# EasyEDA Pro project STM32F429BIT6 IGT6外围.epro, board 最终打板文件
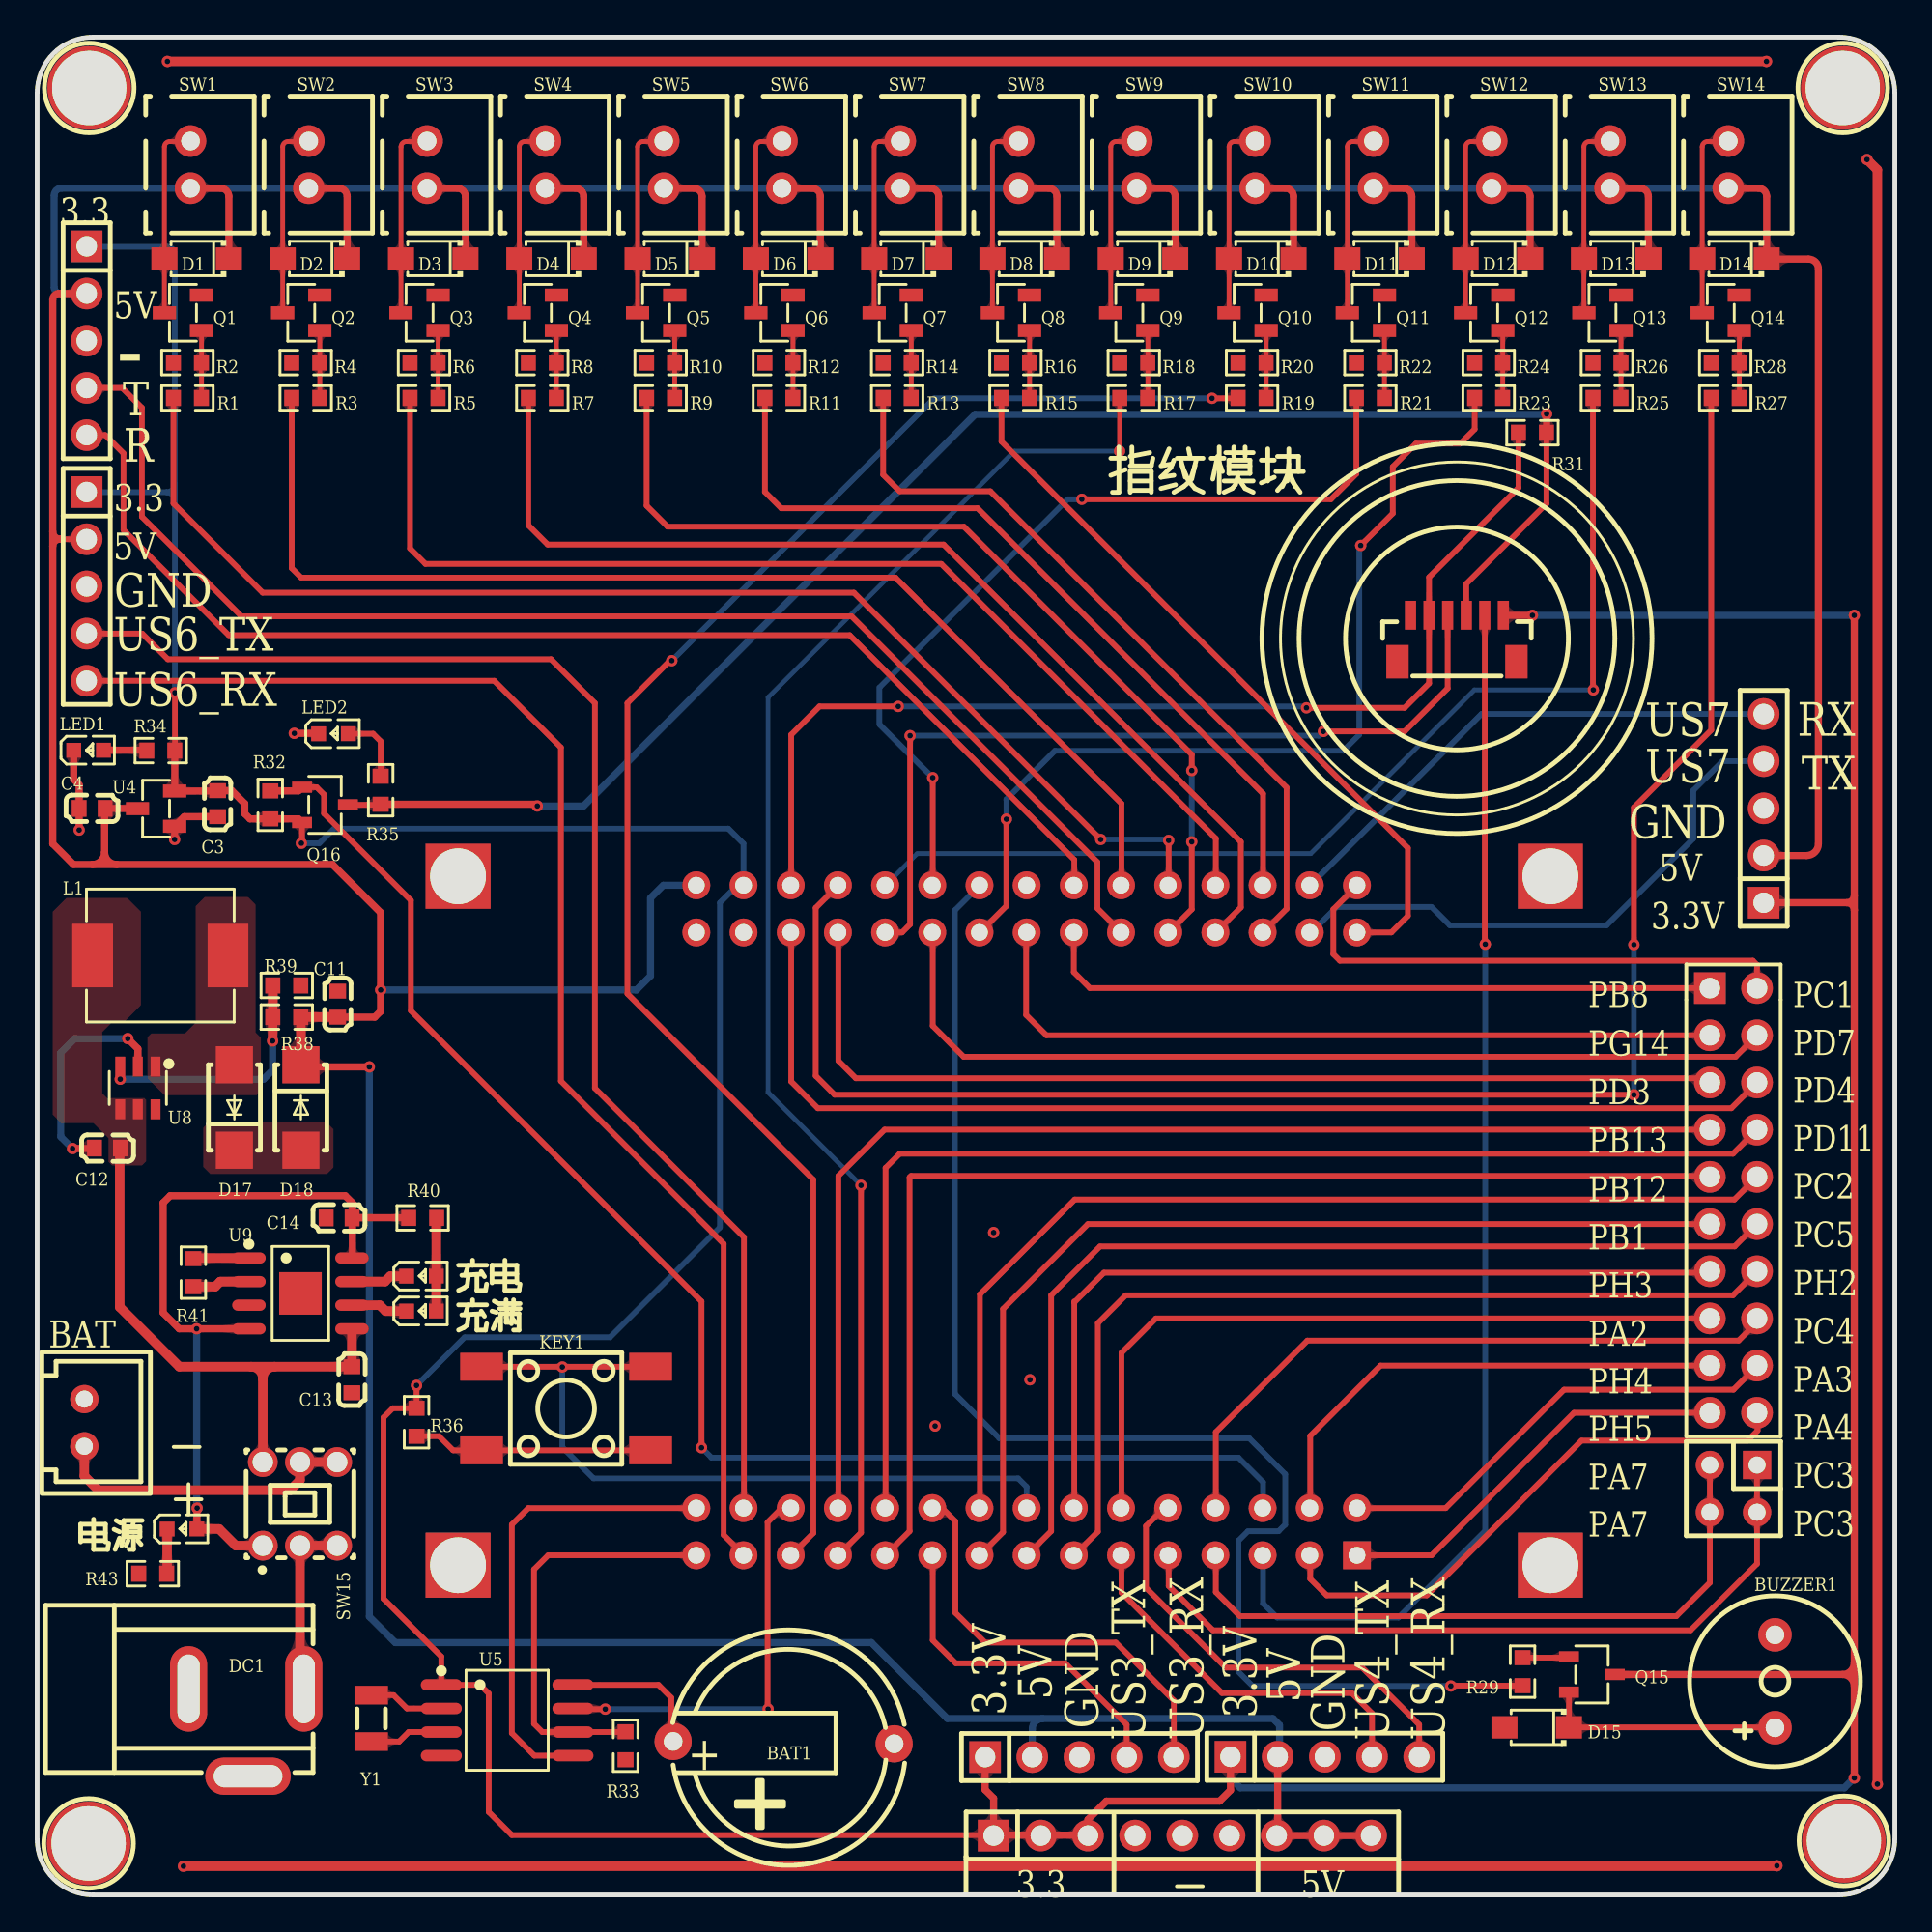
[diagram p5: board, top side]
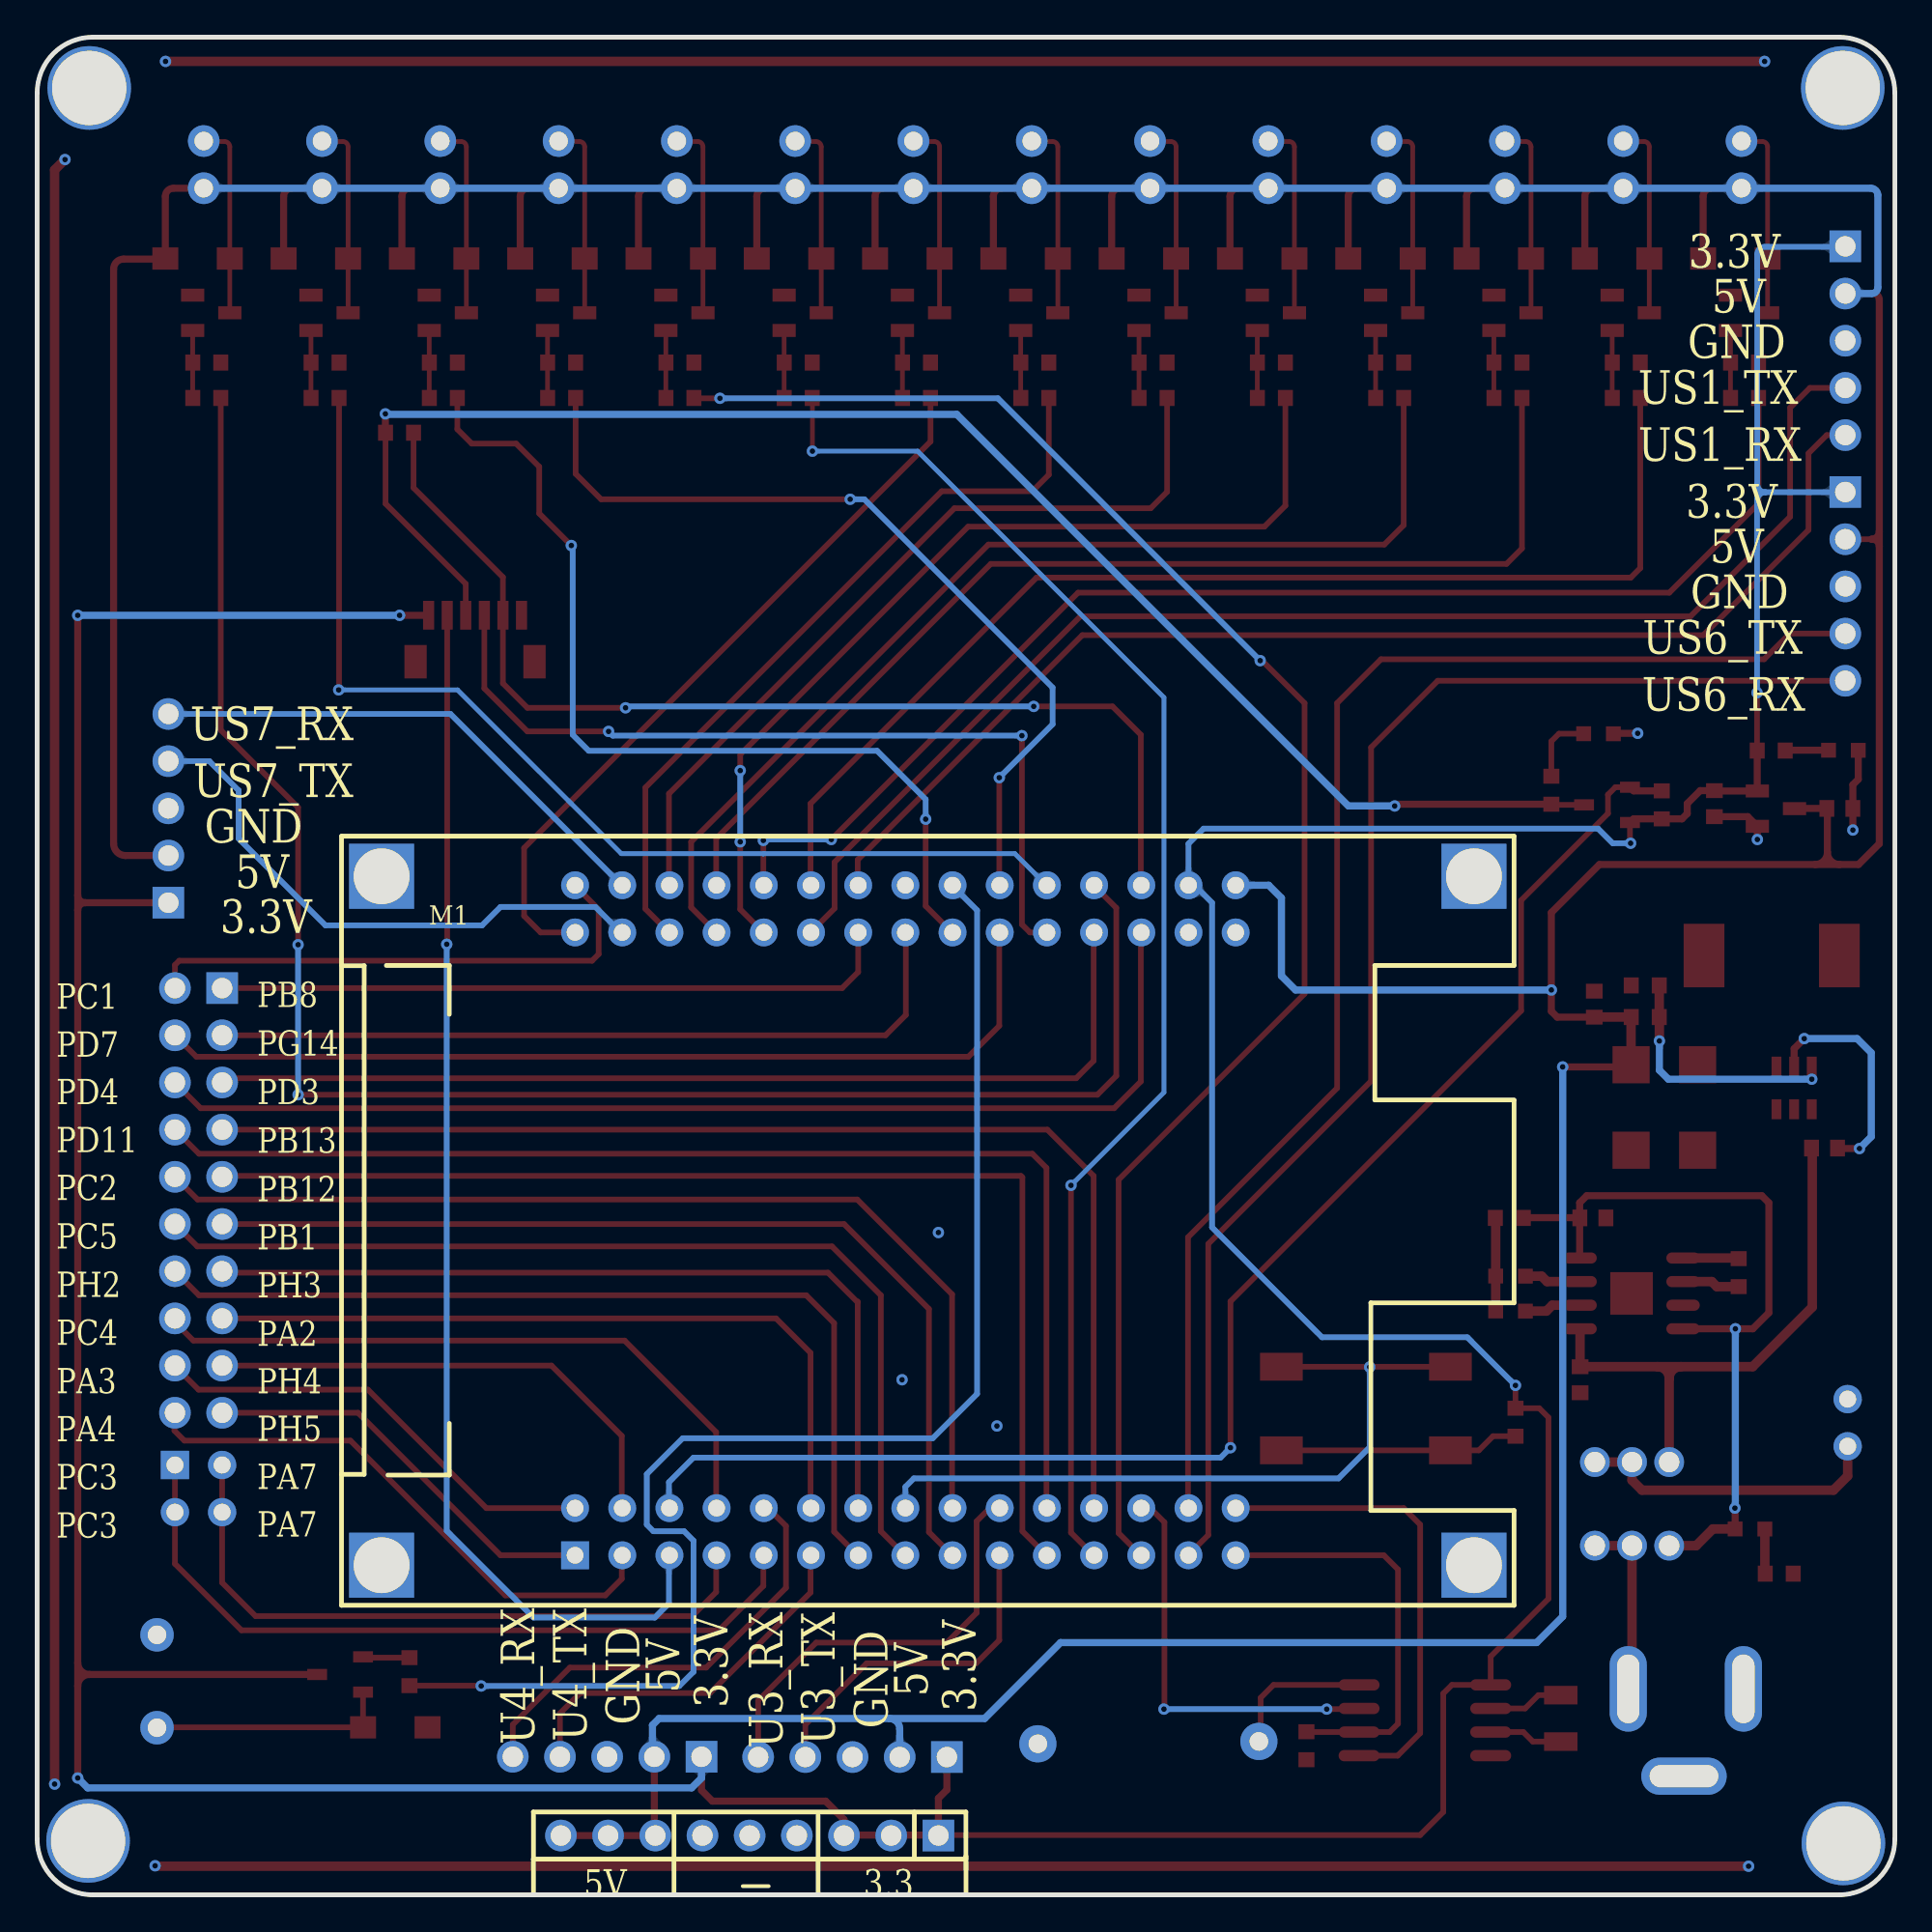
[diagram p6: board, bottom side, seen from below]

Outline 100 x 100 mm; copper layers: Top Layer, Bottom Layer. Coordinates in mm from the lower left corner of the outline.
Outline path: 0,97 0,3 arc(0.88,0.88) 3,0 97,0 arc(99.12,0.88) 100,3 100,97 arc(99.12,99.12) 97,100 3,100 arc(0.88,99.12) 0,97
Stack: Top Layer 0.035mm / Dielectric1 1.51mm FR4 er 4.5 / Bottom Layer 0.035mm

## Design rules (mm)
template: JLCPCB Capability(Two Layers Board)
spacing copperThickness1oz (default): track to track 0.102, other pairs 0.152 to 0.3
spacing copperThickness2oz: track to track 0.203, other pairs 0.152 to 0.3
track width copperThickness1oz (default): min 0.127, default 0.254, max 2.54
track width copperThickness2oz: min 0.203, default 0.254, max 2.54
differential pair differentialPair (default): width min 0.127, default 0.254, max 2.54; gap min 0.152, default 0.152
via viaSize (default): diameter min 0.5, default 0.61, max 10; hole min 0.3, default 0.305, max 6.3

## Placement (name value [footprint] x y rotation side)
BAT1  CR1220-H DIP  [BAT-TH_CR1220-H-DIP]  40.18 8.19 180 top
BUZZER1  2800Hz  [BUZ-TH_BD9.0-P5.00-D0.6-FD]  93.55 11.5 90 top
C3  1uF  [C0603]  9.71 58.74 90 top
C4  1uF  [C0603]  2.96 58.48 0 top
C11  22uF  [C0603]  16.18 47.95 270 top
C12  22uF  [C0603]  3.78 40.2 180 top
C13  10uF  [C0603]  16.94 27.73 270 top
C14  10uF  [C0603]  16.26 36.44 0 top
CN16  XH2.54-LI-2P  [CONN-TH_2P-P2.54_HDR2]  2.54 25.42 270 top
D1  DSK34  [SOD-123FL_L2.7-W1.8-LS3.8-RD]  8.59 88.08 180 top
D2  DSK34  [SOD-123FL_L2.7-W1.8-LS3.8-RD]  14.95 88.08 180 top
D3  DSK34  [SOD-123FL_L2.7-W1.8-LS3.8-RD]  21.32 88.08 180 top
D4  DSK34  [SOD-123FL_L2.7-W1.8-LS3.8-RD]  27.69 88.08 180 top
D5  DSK34  [SOD-123FL_L2.7-W1.8-LS3.8-RD]  34.06 88.08 180 top
D6  DSK34  [SOD-123FL_L2.7-W1.8-LS3.8-RD]  40.42 88.08 180 top
D7  DSK34  [SOD-123FL_L2.7-W1.8-LS3.8-RD]  46.79 88.08 180 top
D8  DSK34  [SOD-123FL_L2.7-W1.8-LS3.8-RD]  53.16 88.08 180 top
D9  DSK34  [SOD-123FL_L2.7-W1.8-LS3.8-RD]  59.53 88.08 180 top
D10  DSK34  [SOD-123FL_L2.7-W1.8-LS3.8-RD]  65.89 88.08 180 top
D11  DSK34  [SOD-123FL_L2.7-W1.8-LS3.8-RD]  72.26 88.08 180 top
D12  DSK34  [SOD-123FL_L2.7-W1.8-LS3.8-RD]  78.63 88.08 180 top
D13  DSK34  [SOD-123FL_L2.7-W1.8-LS3.8-RD]  85 88.08 180 top
D14  DSK34  [SOD-123FL_L2.7-W1.8-LS3.8-RD]  91.37 88.08 180 top
D15  DSK34  [SOD-123FL_L2.7-W1.8-LS3.8-RD]  80.72 9.02 180 top
D17  SS34  [DO-214AC_L4.3-W2.7-LS5.2-RD]  10.62 42.38 90 top
D18  SS34  [DO-214AC_L4.3-W2.7-LS5.2-RD]  14.2 42.38 270 top
DC1  DC005  [DC-IN-TH_DC005]  11.25 8.74 0 top
H1  -  [HDR-TH_5P-P2.54-V-M]  2.67 83.66 270 top
H2  -  [HDR-TH_5P-P2.54-V-M]  56.11 7.42 0 top
H3  -  [HDR-TH_5P-P2.54-V-M]  2.67 70.43 270 top
H4  -  [HDR-TH_5P-P2.54-V-M]  69.32 7.43 0 top
H5  -  [HDR-TH_5P-P2.54-V-M]  92.94 58.49 90 top
H6  -  [HDR-TH_9P-P2.54-V-M]  61.65 3.19 0 top
H7  -  [HDR-TH_20P-P2.54-V-M-R2-C10-S2.54]  91.31 37.38 270 top
H8  -  [HDR-TH_4P-P2.54-V-M-R2-C2-S2.54-1]  91.31 21.87 180 top
KEY1  -  [SW-SMD_4P-L6.0-W6.0-P4.50-LS9.0-2]  28.47 26.18 0 top
L1  0650-22UH  [IND-SMD_L7.8-W7.0_MAPM0630F]  6.63 50.56 180 top
LED1  -  [LED_0603]  2.82 61.62 0 top
LED2  -  [LED_0603]  16 62.51 0 top
LED3  -  [LED_0603]  20.74 33.31 0 top
LED4  -  [LED_0603]  20.74 31.43 0 top
LED5  -  [LED_0603]  7.85 19.7 0 top
M1  STM32F429BIT6-Module  [STM32F429BI_CORE]  53.26 36.31 180 bottom
Q1  AO3400  [SOT-23-3_L2.9-W1.3-P1.90-LS2.4-BR]  7.85 85.16 0 top
Q2  AO3400  [SOT-23-3_L2.9-W1.3-P1.90-LS2.4-BR]  14.22 85.16 0 top
Q3  AO3400  [SOT-23-3_L2.9-W1.3-P1.90-LS2.4-BR]  20.58 85.16 0 top
Q4  AO3400  [SOT-23-3_L2.9-W1.3-P1.90-LS2.4-BR]  26.95 85.16 0 top
Q5  AO3400  [SOT-23-3_L2.9-W1.3-P1.90-LS2.4-BR]  33.32 85.16 0 top
Q6  AO3400  [SOT-23-3_L2.9-W1.3-P1.90-LS2.4-BR]  39.69 85.16 0 top
Q7  AO3400  [SOT-23-3_L2.9-W1.3-P1.90-LS2.4-BR]  46.06 85.16 0 top
Q8  AO3400  [SOT-23-3_L2.9-W1.3-P1.90-LS2.4-BR]  52.42 85.16 0 top
Q9  AO3400  [SOT-23-3_L2.9-W1.3-P1.90-LS2.4-BR]  58.79 85.16 0 top
Q10  AO3400  [SOT-23-3_L2.9-W1.3-P1.90-LS2.4-BR]  65.16 85.16 0 top
Q11  AO3400  [SOT-23-3_L2.9-W1.3-P1.90-LS2.4-BR]  71.53 85.16 0 top
Q12  AO3400  [SOT-23-3_L2.9-W1.3-P1.90-LS2.4-BR]  77.89 85.16 0 top
Q13  AO3400  [SOT-23-3_L2.9-W1.3-P1.90-LS2.4-BR]  84.26 85.16 0 top
Q14  AO3400  [SOT-23-3_L2.9-W1.3-P1.90-LS2.4-BR]  90.63 85.16 0 top
Q15  S8050  [SOT-23-3_L2.9-W1.6-P1.90-LS2.8-BR]  83.69 11.86 180 top
Q16  SI2305  [SOT-23-3_L2.9-W1.6-P1.90-LS2.8-BR]  15.49 58.67 180 top
R1  1K  [R0603]  8.09 80.58 0 top
R2  10K  [R0603]  8.09 82.48 180 top
R3  1K  [R0603]  14.46 80.58 0 top
R4  10K  [R0603]  14.46 82.48 180 top
R5  1K  [R0603]  20.83 80.58 0 top
R6  10K  [R0603]  20.83 82.48 180 top
R7  1K  [R0603]  27.19 80.58 0 top
R8  10K  [R0603]  27.19 82.48 180 top
R9  1K  [R0603]  33.56 80.58 0 top
R10  10K  [R0603]  33.56 82.48 180 top
R11  1K  [R0603]  39.93 80.58 0 top
R12  10K  [R0603]  39.93 82.48 180 top
R13  1K  [R0603]  46.3 80.58 0 top
R14  10K  [R0603]  46.3 82.48 180 top
R15  1K  [R0603]  52.66 80.58 0 top
R16  10K  [R0603]  52.66 82.48 180 top
R17  1K  [R0603]  59.03 80.58 0 top
R18  10K  [R0603]  59.03 82.48 180 top
R19  1K  [R0603]  65.4 80.58 0 top
R20  10K  [R0603]  65.4 82.48 180 top
R21  1K  [R0603]  71.77 80.58 0 top
R22  10K  [R0603]  71.77 82.48 180 top
R23  1K  [R0603]  78.13 80.58 0 top
R24  10K  [R0603]  78.13 82.48 180 top
R25  1K  [R0603]  84.5 80.58 0 top
R26  10K  [R0603]  84.5 82.48 180 top
R27  1K  [R0603]  90.87 80.58 0 top
R28  10K  [R0603]  90.87 82.48 180 top
R29  1K  [R0603]  79.96 12.01 90 top
R31  10K  [R0603]  80.49 78.71 0 top
R32  100K  [R0603]  12.55 58.67 270 top
R33  10K  [R0603]  31.67 8.03 90 top
R34  5.1K  [R0603]  6.66 61.59 0 top
R35  5.1K  [R0603]  18.49 59.46 270 top
R36  1K  [R0603]  20.42 25.44 90 top
R38  16K  [R0603]  13.44 47.25 0 top
R39  2.2K  [R0603]  13.44 48.95 180 top
R40  1K  [R0603]  20.75 36.44 180 top
R41  RPOG-1k  [R0603]  8.41 33.49 270 top
R43  5.1K  [R0603]  6.22 17.29 0 top
SW1  B2B-XH-A(LF)(SN)  [CONN-TH_B2B-XH-A-LF-SN]  8.25 93.14 270 top
SW2  B2B-XH-A(LF)(SN)  [CONN-TH_B2B-XH-A-LF-SN]  14.62 93.14 270 top
SW3  B2B-XH-A(LF)(SN)  [CONN-TH_B2B-XH-A-LF-SN]  20.99 93.14 270 top
SW4  B2B-XH-A(LF)(SN)  [CONN-TH_B2B-XH-A-LF-SN]  27.36 93.14 270 top
SW5  B2B-XH-A(LF)(SN)  [CONN-TH_B2B-XH-A-LF-SN]  33.73 93.14 270 top
SW6  B2B-XH-A(LF)(SN)  [CONN-TH_B2B-XH-A-LF-SN]  40.09 93.14 270 top
SW7  B2B-XH-A(LF)(SN)  [CONN-TH_B2B-XH-A-LF-SN]  46.46 93.14 270 top
SW8  B2B-XH-A(LF)(SN)  [CONN-TH_B2B-XH-A-LF-SN]  52.83 93.14 270 top
SW9  B2B-XH-A(LF)(SN)  [CONN-TH_B2B-XH-A-LF-SN]  59.2 93.14 270 top
SW10  B2B-XH-A(LF)(SN)  [CONN-TH_B2B-XH-A-LF-SN]  65.56 93.14 270 top
SW11  B2B-XH-A(LF)(SN)  [CONN-TH_B2B-XH-A-LF-SN]  71.93 93.14 270 top
SW12  B2B-XH-A(LF)(SN)  [CONN-TH_B2B-XH-A-LF-SN]  78.3 93.14 270 top
SW13  B2B-XH-A(LF)(SN)  [CONN-TH_B2B-XH-A-LF-SN]  84.67 93.14 270 top
SW14  B2B-XH-A(LF)(SN)  [CONN-TH_B2B-XH-A-LF-SN]  91.03 93.14 270 top
SW15  自锁开关 5.8Z白灰白260G  [SW-TH_6P-L5.8-W5.8-P2.00-LS4.5-TR]  14.15 21.05 180 top
TP1  -  [M4螺丝]  2.77 2.77 0 top
TP2  -  [M4螺丝]  97.26 2.9 0 top
TP3  -  [M4螺丝]  2.8 97.27 0 top
TP4  -  [M4螺丝]  97.2 97.27 0 top
U2  指纹模块  [conn-smd_a1002wv-s-6p]  76.43 67.63 0 top
U4  XC6206  [SOT-23-3_L2.9-W1.3-P1.90-LS2.4-BR]  6.4 58.47 0 top
U5  DS1302S+TR  [SOP-8_L5.3-W5.3-P1.27-LS8.0-BL]  25.3 9.4 270 top
U8  MT3608  [SOT-23-6_L2.9-W1.6-P0.95-LS2.8-BL]  5.42 43.44 180 top
U9  AP5056  [SOP-8_L4.9-W3.9-P1.27-LS6.0-BL-EP]  14.17 32.38 270 top
Y1  32.768kHz  [FC-135R_L3.2-W1.5]  17.98 9.5 90 top

## Footprints (pads in the part's own frame, mm; a bottom-side part is the same pattern mirrored in y, then rotated)
BAT-TH_CR1220-H-DIP
  round 2 hole 1: 1(-5.949,0.064) 2(5.949,-0.064)
BUZ-TH_BD9.0-P5.00-D0.6-FD
  round 1.8 hole 1: 1(-2.5,0) 2(2.5,0)
C0603
  rect 0.8x0.9 smd: 1(-0.7,0) 2(0.7,0)
conn-smd_a1002wv-s-6p
  rect 0.6x1.55 smd: 1(2.499,1.251) 2(1.499,1.251) 3(0.501,1.25) 4(-0.501,1.251) 5(-1.501,1.251) 6(-2.501,1.251)
  rect 1.2x1.8 smd: 7(3.201,-1.251) 8(-3.201,-1.251)
CONN-TH_2P-P2.54_HDR2
  round 1.524 hole 0.914: 1(1.27,0) 2(-1.27,0)
CONN-TH_B2B-XH-A-LF-SN
  round 1.7 hole 1: 1(1.27,0) 2(-1.27,0)
DC-IN-TH_DC005
  oval 2x4.6 hole 1.2x3.7: 1(3.1,2.35) 2(-3.1,2.35)
  oval 4.6x2 hole 3.7x1.2: 3(0.1,-2.35)
DO-214AC_L4.3-W2.7-LS5.2-RD
  rect 2x2 smd: 1(-2.3,0) 2(2.3,0)
FC-135R_L3.2-W1.5
  rect 1x1.8 smd: 1(-1.25,0) 2(1.25,0)
HDR-TH_4P-P2.54-V-M-R2-C2-S2.54-1
  rect 1.524x1.524 hole 0.914: 1(-1.27,-1.27)
  round 1.524 hole 0.914: 2(-1.27,1.27) 3(1.27,-1.27) 4(1.27,1.27)
HDR-TH_5P-P2.54-V-M
  rect 1.7x1.7 hole 1.1: 1(-5.08,0)
  round 1.7 hole 1.1: 2(-2.54,0) 3(0,0) 4(2.54,0) 5(5.08,0)
HDR-TH_9P-P2.54-V-M
  rect 1.7x1.7 hole 1.1: 1(-10.16,0)
  round 1.7 hole 1.1: 2(-7.62,0) 3(-5.08,0) 4(-2.54,0) 5(0,0) 6(2.54,0) 7(5.08,0) 8(7.62,0) 9(10.16,0)
HDR-TH_20P-P2.54-V-M-R2-C10-S2.54
  rect 1.7x1.7 hole 1.1: 1(-11.43,-1.27)
  round 1.7 hole 1.1: 2(-11.43,1.27) 3(-8.89,-1.27) 4(-8.89,1.27) 5(-6.35,-1.27) 6(-6.35,1.27) 7(-3.81,-1.27) 8(-3.81,1.27) 9(-1.27,-1.27) 10(-1.27,1.27) 11(1.27,-1.27) 12(1.27,1.27) 13(3.81,-1.27) 14(3.81,1.27) 15(6.35,-1.27) 16(6.35,1.27) 17(8.89,-1.27) 18(8.89,1.27) 19(11.43,-1.27) 20(11.43,1.27)
IND-SMD_L7.8-W7.0_MAPM0630F
  rect 2.194x3.42 smd: 1(3.643,0) 2(-3.643,0)
LED_0603
  rect 0.8x0.8 smd: 1(-0.851,-0.01) 2(0.75,-0.005)
M4螺丝
  round 4.5 hole 4: 1(0,0)
R0603
  rect 0.806x0.864 smd: 1(-0.753,0) 2(0.753,0)
SOD-123FL_L2.7-W1.8-LS3.8-RD
  rect 1.4x1.2 smd: 1(-1.735,0) 2(1.735,0)
SOP-8_L4.9-W3.9-P1.27-LS6.0-BL-EP
  oval 0.6x1.8 smd: 1(-1.905,-2.772) 2(-0.635,-2.772) 3(0.635,-2.772) 4(1.905,-2.772) 5(1.905,2.772) 6(0.635,2.772) 7(-0.635,2.772) 8(-1.905,2.772)
  rect 2.29x2.29 smd: 9(0,0)
SOP-8_L5.3-W5.3-P1.27-LS8.0-BL
  oval 0.609x2.204 smd: 1(-1.905,-3.542) 2(-0.635,-3.542) 3(0.635,-3.542) 4(1.905,-3.542) 5(1.905,3.542) 6(0.635,3.542) 7(-0.635,3.542) 8(-1.905,3.542)
SOT-23-3_L2.9-W1.3-P1.90-LS2.4-BR
  rect 1.25x0.7 smd: 1(1,-0.95) 2(1,0.95) 3(-1,0)
SOT-23-3_L2.9-W1.6-P1.90-LS2.8-BR
  rect 1.07x0.6 smd: 1(1.235,-0.95) 2(1.235,0.95) 3(-1.235,0)
SOT-23-6_L2.9-W1.6-P0.95-LS2.8-BL
  rect 0.532x1.072 smd: 1(-0.95,-1.149) 2(0,-1.149) 3(0.95,-1.149) 4(0.95,1.149) 5(0,1.149) 6(-0.95,1.149)
STM32F429BI_CORE
  rect 3.5x3.5 hole 3.005x3: 0(30.607,18.517) 61(30.607,-18.567) 62(-28.194,-18.567) 63(-28.194,18.517)
  rect 1.5x1.5 hole 0.905x0.9: 1(-17.78,-18.034)
  round 1.5 hole 0.905x0.9: 2(-17.78,-15.494) 3(-15.24,-18.034) 4(-15.24,-15.494) 5(-12.7,-18.034) 6(-12.7,-15.494) 7(-10.16,-18.034) 8(-10.16,-15.494) 9(-7.62,-18.034) 10(-7.62,-15.494) 11(-5.08,-18.034) 12(-5.08,-15.494) 13(-2.54,-18.034) 14(-2.54,-15.494) 15(0,-18.034) 16(0,-15.494) 17(2.54,-18.034) 18(2.54,-15.494) 19(5.08,-18.034) 20(5.08,-15.494) 21(7.62,-18.034) 22(7.62,-15.494) 23(10.16,-18.034) 24(10.16,-15.494) 25(12.7,-18.034) 26(12.7,-15.494) 27(15.24,-18.034) 28(15.24,-15.494) 29(17.78,-18.034) 30(17.78,-15.494) 31(-17.78,15.494) 32(-17.78,18.034) 33(-15.24,15.494) 34(-15.24,18.034) 35(-12.7,15.494) 36(-12.7,18.034) 37(-10.16,15.494) 38(-10.16,18.034) 39(-7.62,15.494) 40(-7.62,18.034) 41(-5.08,15.494) 42(-5.08,18.034) 43(-2.54,15.494) 44(-2.54,18.034) 45(0,15.494) 46(0,18.034) 47(2.54,15.494) 48(2.54,18.034) 49(5.08,15.494) 50(5.08,18.034) 51(7.62,15.494) 52(7.62,18.034) 53(10.16,15.494) 54(10.16,18.034) 55(12.7,15.494) 56(12.7,18.034) 57(15.24,15.494) 58(15.24,18.034) 59(17.78,15.494) 60(17.78,18.034)
SW-SMD_4P-L6.0-W6.0-P4.50-LS9.0-2
  rect 2.3x1.5 smd: 1(-4.55,2.25) 2(4.55,2.25) 3(-4.55,-2.25) 4(4.55,-2.25)
SW-TH_6P-L5.8-W5.8-P2.00-LS4.5-TR
  round 1.6 hole 1.1: 1(2,2.25) 2(0,2.25) 3(-2,2.25) 4(-2,-2.25) 5(0,-2.25) 6(2,-2.25)

## Nets
As in the schematic, except:
$4N6183: LED3.2 LED4.2 R40.1
$4N6184: LED3.1 U9.7
$4N6185: LED4.1 U9.6

Pads without a net: M1 0 46 57 61 62 63; TP1 1; TP2 1; TP3 1; TP4 1; U2 7 8; U8 6

## Via types
v1: diameter 0.61, hole 0.305, Top Layer to Bottom Layer, 53 vias

## Routing (per net, layer and track width the routed paths; a pad name or vN(x,y) marks a point on that pad's centre or on a via; arc(x,y) is an arc through that point)
+3.3V: length 327.1
  Top Layer w0.305: R34.2 7.42,61.6 v1(7.42,64.71) ; 51.49,3.22 25.55,3.22 24.31,4.46 24.31,10.84 23.84,11.3 U5.1 21.76,12.83 18.64,15.94 18.64,25.7 19.14,26.19 R36.2 v1(20.42,27.42) ; Q16.2 14.26,56.61 v1(14.23,56.61)
  Top Layer w0.381: 97.82,11.23 97.82,12.49 ; 97.82,11.23 v1(97.82,6.29) ; 97.82,11.23 arc(97.63,11.68) 97.19,11.86 ; 97.82,12.49 97.82,53.01 ; 97.82,12.49 arc(97.63,12.05) 97.19,11.86 ; v1(80.49,68.88) 78.93,68.88 U2.1 ; Q16.2 14.06,57.92 R32.2 11.46,57.92 11.18,58.2 11.18,58.74 10.48,59.44 C3.2 9.7,59.42 U4.2 7.41,59.43 R34.2 ; 97.82,53.81 v1(97.82,68.88) ; 97.82,53.81 97.82,53.01 ; 97.82,53.81 arc(97.7,53.52) 97.42,53.41 ; 97.82,53.01 arc(97.7,53.29) 97.42,53.41 ; H4.1 64.24,5.63 63.65,5.05 57.56,5.05 56.57,4.06 H6.3 56.54,3.22 51.49,3.22 51.49,5.2 51.03,5.66 H2.1 ; 97.42,53.41 H5.1 ; Q15.3 97.19,11.86
  Bottom Layer w0.305: 7.41,75.94 7.41,88.32 arc(7.29,88.6) 7.01,88.71 2.69,88.71 H1.1 ; 7.41,75.94 7.42,75.93 v1(7.42,64.71) ; 7.41,75.94 arc(7.28,75.63) 6.98,75.5 6.97,75.5 ; 6.97,75.5 2.68,75.5 H3.1 ; 6.97,75.5 arc(7.28,75.38) 7.41,75.06 ; v1(14.22,56.61) 15.19,56.61 15.98,57.39 37.21,57.39 38.02,56.58 M1.58 37.69,54.35 36.75,53.41 36.75,35.93 30.84,30.01 23.01,30.01 v1(20.42,27.42)
  Bottom Layer w0.381: v1(97.82,68.88) v1(80.49,68.88) ; v1(97.82,6.29) 97.28,5.76 64.77,5.76 64.24,6.29 H4.1
+5V: length 405.5
  Top Layer w0.305: 1.25,72.97 H3.2
  Top Layer w0.381: D3.1 23.06,91.43 arc(22.93,91.74) 22.62,91.87 SW3.1 ; 0.84,72.59 0.84,56.58 1.96,55.46 2.98,55.46 ; 0.84,72.59 0.84,73.39 ; 0.84,72.59 arc(0.95,72.86) 1.22,72.97 1.25,72.97 arc(0.96,73.1) 0.84,73.39 ; SW4.1 28.98,91.87 arc(29.29,91.74) 29.42,91.43 D4.1 ; SW6.1 41.72,91.87 arc(42.03,91.74) 42.16,91.43 D6.1 ; D5.1 35.79,91.43 arc(35.66,91.74) 35.35,91.87 SW5.1 ; SW11.1 73.56,91.87 arc(73.87,91.74) 74,91.43 D11.1 ; SW14.1 92.66,91.87 arc(92.97,91.74) 93.1,91.43 D14.1 93.13,88.05 95.35,88.05 arc(95.73,87.9) 95.88,87.52 95.88,56.58 arc(95.7,56.13) 95.25,55.95 H5.2 ; D2.1 16.69,91.43 arc(16.56,91.74) 16.25,91.87 SW2.1 ; SW7.1 48.09,91.87 arc(48.4,91.74) 48.53,91.43 D7.1 ; 4.29,55.46 15.9,55.46 18.49,52.87 v1(18.49,48.71) 18.49,47.56 18.17,47.25 C11.2 ; 4.29,55.46 2.98,55.46 ; 4.29,55.46 arc(3.82,55.66) 3.63,56.12 ; 2.98,55.46 arc(3.44,55.66) 3.63,56.12 ; SW8.1 54.45,91.87 arc(54.77,91.74) 54.89,91.43 D8.1 ; v1(17.88,44.57) 14.31,44.57 D18.1 ; SW1.1 9.88,91.87 arc(10.19,91.74) 10.32,91.43 D1.1 ; D13.1 86.73,91.43 arc(86.6,91.74) 86.29,91.87 SW13.1 ; U4.3 5.39,58.48 C4.2 3.63,58.45 3.63,56.12 ; H4.2 66.78,3.24 66.73,3.19 H6.9 ; D10.1 67.63,91.43 arc(67.5,91.74) 67.19,91.87 SW10.1 ; SW9.1 60.82,91.87 arc(61.13,91.74) 61.26,91.43 61.26,88.08 ; 0.84,73.39 0.84,85.87 arc(0.93,86.1) 1.17,86.2 H1.2 ; D12.1 80.37,91.43 arc(80.24,91.74) 79.93,91.87 SW12.1
  Top Layer w0.508: C11.2 16.17,47.25 14.19,47.25 14.2,47.24 D18.1
  Bottom Layer w0.381: H2.2 53.57,8.93 arc(53.64,9.2) 53.83,9.41 arc(53.97,9.47) 54.13,9.49 ; v1(17.88,44.57) 17.88,14.98 19.28,13.58 44.91,13.58 49,9.49 54.13,9.49 ; H1.2 1.24,86.2 arc(1.01,86.3) 0.91,86.53 0.91,91.48 arc(1.03,91.75) 1.3,91.87 SW1.1 SW2.1 SW3.1 SW4.1 SW5.1 SW6.1 SW7.1 SW8.1 SW9.1 SW10.1 SW11.1 SW12.1 SW13.1 SW14.1 ; H4.2 66.88,7.53 66.88,9.13 66.52,9.49 54.13,9.49 ; 18.49,48.71 32.26,48.71 33.02,49.47 33.02,53.66 33.71,54.35 M1.60
GND: length 283.8
  Top Layer w0.381: C12.2 3.06,40.17 v1(1.91,40.17) ; v1(2.26,57.32) C4.1 2.26,59.76 1.97,60.05 LED1.1 ; C3.1 7.92,58.04 U4.1 v1(7.4,56.81) ; U8.2 5.42,45.55 v1(4.88,46.09) ; v1(13.84,62.53) 15.12,62.53 LED2.1
  Top Layer w0.508: v1(93.09,98.7) v1(7.01,98.7) ; U9.1 8.44,34.28 R41.1 ; v1(99.06,5.96) 99.06,92.85 v1(98.5,93.41) ; v1(7.87,1.54) 93.62,1.54 v1(93.65,1.57)
  Bottom Layer w0.381: v1(1.91,40.17) 1.27,40.81 1.27,45.33 2.03,46.09 v1(4.88,46.09)
  Bottom Layer w0.508: v1(93.09,98.7) 93.09,98.67
  vias: v1(48.34,25.24) v1(51.49,35.65) v1(53.44,27.73)
VBAT: length 31
  Top Layer w0.508: C12.1 4.45,40.16 4.45,31.64 7.65,28.43 11.52,28.43 ; 12.15,27.8 12.15,27.85 ; 12.15,27.8 SW15.6 ; 12.15,27.8 arc(12.33,28.25) 12.78,28.43 ; 12.15,27.8 arc(11.96,28.25) 11.52,28.43 ; 11.52,28.43 12.78,28.43 ; 12.78,28.43 16.95,28.43 ; 16.95,28.43 U9.5 ; 16.95,28.43 C13.1
VCC: length 42.1
  Top Layer w0.381: 16.97,36.45 C14.2 ; 16.97,36.45 19.99,36.45 R40.2 ; 16.97,36.45 16.97,34.3 U9.8 ; 16.97,36.45 16.97,37.25 16.59,37.63 7.16,37.63 6.78,37.25 6.78,31.33 7.65,30.47 v1(8.59,30.47) U9.4 ; v1(8.61,20.82) 8.6,20.81 LED5.2
  Top Layer w0.508: LED5.2 9.79,19.7 10.69,18.8 SW15.1
  Bottom Layer w0.381: v1(8.59,30.47) 8.59,20.84 v1(8.61,20.82)
AF8_USART4_RX: length 24.4
  Top Layer w0.305: H4.5 74.4,9.16 71.32,12.23 63.98,12.23 59.69,16.53 59.69,19.85 60.66,20.82 60.91,20.82
AF8_USART4_TX: length 20.5
  Top Layer w0.305: H4.4 71.86,9.77 70.76,10.86 63.78,10.86 58.37,16.27 58.37,18.28
AF8_USART7_RX: length 28.2
  Bottom Layer w0.305: 68.53,54.35 77.75,63.57 H5.5
AF8_USART7_TX: length 30.6
  Bottom Layer w0.305: H5.4 90.73,61.03 89.15,59.45 89.15,56.86 84.48,52.19 76.05,52.19 75.06,53.18 69.95,53.18 68.58,51.81 68.53,51.81
BUZZER: length 75.8
  Top Layer w0.305: v1(76.1,11.24) 76.12,11.26 R29.1
  Bottom Layer w0.305: v1(76.1,11.24) 65.43,11.24 64.67,12 64.67,19.07 65.18,19.57 66.83,19.57 67.18,19.93 67.18,22.65 65.25,24.58 51.79,24.58 49.4,26.97 49.4,53 50.75,54.35
DS1302_CE: length 25.3
  Top Layer w0.305: U5.5 26.76,7.49 25.55,8.7 25.55,19.93 26.44,20.82 35.51,20.82
DS1302_I/O: length 22.5
  Top Layer w0.305: R33.2 31.66,8.76 U5.6 27.19,8.76 26.75,9.21 26.75,17.52 27.51,18.28 35.51,18.28
DS1302_SWCLK: length 22.2
  Top Layer w0.305: U5.7 28.88,10 v1(30.58,10) ; 40.59,20.82 40.08,20.82 39.32,20.06 39.32,10.02 v1(39.34,10)
  Bottom Layer w0.305: v1(39.34,10) v1(30.58,10)
KEY_SOS: length 40.5
  Top Layer w0.305: 28.26,28.43 23.92,28.43 ; 28.26,28.43 33.02,28.43 ; 28.26,28.43 28.27,28.42 v1(28.27,28.41)
  Bottom Layer w0.305: v1(28.27,28.41) 28.27,24.1 29.95,22.42 52.81,22.42 53.26,21.96 M1.16
PA2: length 40.8
  Top Layer w0.305: 90.07,31.03 60.22,31.03 58.37,29.18 58.37,20.82
PA3: length 24.7
  Top Layer w0.305: 71.07,20.82 75.82,20.82 82.19,27.19 91.31,27.19 92.61,28.49
PA4: length 30.4
  Top Layer w0.305: 92.61,25.95 92.61,24.98 92.07,24.45 83.13,24.45 74.8,16.12 69.42,16.12 68.53,17.01 68.53,18.28
PA7: length 36.2
  Top Layer w0.305: 63.45,18.28 63.45,16.3 64.74,15 88.24,15 90.04,16.81 H8.4 H8.3
PB1: length 53.7
  Top Layer w0.305: 50.75,18.28 51.99,19.52 51.99,31.54 56.57,36.11 H7.11
PB8: length 36.7
  Top Layer w0.305: H7.1 56.67,48.81 55.8,49.67 55.8,51.78 55.83,51.81
PB12: length 64
  Top Layer w0.305: H7.9 89.99,38.7 47.04,38.7 46.96,38.62 46.96,19.57 45.67,18.28
PB13: length 65.8
  Top Layer w0.305: 43.13,20.82 43.13,38.7 45.62,41.19 H7.7
PC1: length 28.5
  Top Layer w0.305: H7.2 92.58,50.05 92.35,50.28 70.13,50.28 69.77,50.64 69.77,53.05 71.07,54.35
PC2: length 56
  Top Layer w0.305: 50.75,20.82 50.75,32.32 55.85,37.43 91.36,37.43 H7.10
PC3: length 41.1
  Top Layer w0.305: H8.1 H8.2 92.58,17.82 89,14.24 63.3,14.24 60.91,16.63 60.91,18.28
PC4: length 35.9
  Top Layer w0.305: 92.61,31.03 92.61,30.85 91.59,29.84 68.38,29.84 63.45,24.91 63.45,20.82
PC5: length 54.1
  Top Layer w0.305: H7.12 91.38,34.9 57.22,34.9 54.58,32.27 54.58,19.57 53.29,18.28
PD3: length 54.3
  Top Layer w0.305: 43.13,51.81 43.13,44.9 44.07,43.96 89.81,43.96 H7.5
PD4: length 61.2
  Top Layer w0.305: 40.59,51.81 40.59,43.78 42.03,42.34 91.2,42.34 H7.6
PD7: length 50.6
  Top Layer w0.305: H7.4 91.43,45.12 49.87,45.12 48.21,46.78 48.21,51.81
PD11: length 66.1
  Top Layer w0.305: H7.8 91.29,39.89 46.43,39.89 45.67,39.13 45.67,20.82
PG14: length 41.7
  Top Layer w0.305: 53.29,51.81 53.24,51.76 53.24,47.36 54.33,46.27 H7.3
PH2: length 49.7
  Top Layer w0.305: 55.83,18.28 57.1,19.55 57.1,30.78 58.6,32.27 91.29,32.27 H7.14
PH3: length 46
  Top Layer w0.305: H7.13 89.97,33.49 57.43,33.49 55.83,31.89 ; 55.83,31.89 55.83,31.94 ; 55.83,31.89 55.83,20.82
PH4: length 27
  Top Layer w0.305: 90.07,28.49 72.31,28.49 68.53,24.7 68.53,20.82
PH5: length 22.2
  Top Layer w0.305: 71.07,18.28 75.06,18.28 82.73,25.95 90.07,25.95
POW_EN: length 79.1
  Top Layer w0.305: v1(35.76,24.07) 35.76,31.94 20.12,47.59 20.12,53.53 15.44,58.21 15.44,59.22 15.04,59.62 Q16.1
  Top Layer w0.381: R32.1 14.06,59.43 Q16.1
  Bottom Layer w0.305: 65.99,20.82 65.99,22.22 64.67,23.54 36.3,23.54 v1(35.76,24.07)
SW1: length 69.2
  Top Layer w0.305: 60.91,54.35 v1(60.91,56.76) ; R1.1 7.34,74.9 12.14,70.09 43.97,70.09 v1(57.25,56.81)
  Bottom Layer w0.305: v1(60.91,56.76) 60.86,56.81 v1(57.25,56.81)
SW2: length 63.5
  Top Layer w0.305: 58.37,54.35 58.37,58.74 46.2,70.91 14.21,70.91 13.7,71.42 13.7,80.58
SW3: length 60.5
  Top Layer w0.305: 63.45,54.35 63.45,56.86 48.67,71.64 20.9,71.64 20.07,72.48 R5.1
SW4: length 57.7
  Top Layer w0.305: 63.45,51.81 64.8,53.15 64.8,56.68 48.79,72.69 27.48,72.69 26.44,73.73 R7.1
SW5: length 50.8
  Top Layer w0.305: v1(62.15,60.52) 62.15,61.38 49.89,73.65 33.93,73.65 32.81,74.78 R9.1 ; 60.91,51.81 62.15,53.05 v1(62.15,56.68)
  Bottom Layer w0.305: v1(62.15,56.68) v1(62.15,60.52)
SW6: length 43.5
  Top Layer w0.305: R11.1 39.18,75.52 40.06,74.64 50.62,74.64 65.99,59.27 65.99,54.35
SW7: length 41.1
  Top Layer w0.305: 65.99,51.81 67.26,53.08 67.26,59.6 51.31,75.56 46.43,75.56 45.54,76.44 R13.1
SW8: length 40
  Top Layer w0.305: R15.1 51.91,78.23 73.79,56.35 73.79,52.7 72.9,51.81 71.07,51.81
SW9: length 76
  Top Layer w0.254: R17.1 58.27,80.57 v1(58.27,77.71)
  Top Layer w0.305: 43.13,18.28 44.35,19.5 v1(44.35,38.19)
  Bottom Layer w0.254: v1(58.27,77.71) 52.6,77.71 39.34,64.46 39.34,43.2 v1(44.35,38.19)
SW10: length 90.2
  Top Layer w0.305: v1(63.25,80.56) 64.63,80.56 R19.1 ; v1(34.16,66.44) 34.06,66.44 31.78,64.15 31.78,48.5 41.78,38.5 41.78,19.47 40.59,18.28
  Bottom Layer w0.305: v1(34.16,66.44) 48.29,80.56 v1(63.25,80.56)
SW11: length 46.4
  Top Layer w0.305: 48.21,54.35 v1(48.21,60.14) ; R21.1 71.01,76.5 69.64,75.12 v1(56.24,75.12)
  Bottom Layer w0.305: v1(48.21,60.14) 45.34,63.01 45.34,64.99 55.47,75.12 v1(56.24,75.12)
SW12: length 50.4
  Top Layer w0.305: 50.75,51.81 52.17,53.23 52.17,58.06 ; R23.1 77.38,78.9 76.61,78.12 74.22,78.12 72.97,76.88 72.97,74.36 v1(71.25,72.63)
  Bottom Layer w0.305: v1(52.17,57.9) 52.17,58.97 54.79,61.59 70.31,61.59 71.17,62.45 71.17,72.56 v1(71.25,72.63)
SW13: length 58.2
  Top Layer w0.254: v1(83.77,64.86) 83.75,64.86
  Top Layer w0.305: R25.1 83.75,64.88 v1(83.77,64.86)
  Bottom Layer w0.254: 60.88,56.05 47.37,56.05 45.67,54.35 ; 60.88,56.05 60.91,56.02 ; 60.88,56.05 68.55,56.05 77.37,64.86 v1(83.77,64.86)
SW14: length 94.5
  Top Layer w0.305: v1(85.95,43.07) 42.93,43.07 41.91,44.09 41.91,53.13 43.13,54.35 ; v1(85.95,51.15) 85.95,58.54 90.12,62.7 R27.1
  Bottom Layer w0.305: v1(85.95,43.07) v1(85.95,51.15)
TOUCH3.3V: length 86
  Top Layer w0.305: U2.3 76.93,70.57 81.25,74.89 R31.2 ; R35.2 18.46,58.67 Q16.3
  Top Layer w0.381: R31.2 81.25,78.71 v1(81.25,79.72) ; R35.2 26.83,58.71 v1(26.92,58.61)
  Bottom Layer w0.381: v1(81.25,79.72) 81.23,79.7 50.5,79.7 29.41,58.61 v1(26.92,58.61)
TOUCH_OUT: length 66.1
  Top Layer w0.305: U2.2 77.93,51.2 v1(77.95,51.17)
  Bottom Layer w0.305: 65.99,18.28 65.99,15.69 66.75,14.93 73.28,14.93 77.95,19.6 v1(77.95,51.17)
TOUCH_RX: length 59.1
  Top Layer w0.305: R31.1 79.74,75.74 74.93,70.93 U2.5 74.93,65.22 73.61,63.9 v1(68.33,63.9) ; v1(46.35,63.97) 42.11,63.97 40.59,62.45 40.59,54.35
  Bottom Layer w0.305: v1(68.33,63.9) 68.25,63.97 v1(46.35,63.97)
TOUCH_TX: length 45.6
  Top Layer w0.305: v1(69.24,62.63) 73.61,62.63 75.93,64.95 U2.4 ; 45.67,51.81 46.56,51.81 46.99,52.24 v1(46.99,62.4)
  Bottom Layer w0.305: v1(46.99,62.4) 69.01,62.4 v1(69.24,62.63)
USART1_RX: length 66.4
  Top Layer w0.305: 55.83,54.35 55.83,55.72 43.74,67.81 10.31,67.81 4.65,73.47 4.65,77.6 3.67,78.58 H1.5
USART1_TX: length 72.7
  Top Layer w0.305: H1.4 4.57,81.12 5.64,80.05 5.64,74.18 11,68.82 43.84,68.82 57.07,55.59 57.07,53.1 58.37,51.81
USART3_RX: length 23.2
  Top Layer w0.305: H2.5 61.19,10.46 58.06,13.58 51.03,13.58 49.43,15.18 49.43,20.11 48.72,20.82 48.21,20.82
USART3_TX: length 18.6
  Top Layer w0.305: 48.21,18.28 48.21,13.71 49.45,12.46 55.35,12.46 58.65,9.16 H2.4
USART6_RX: length 74.6
  Top Layer w0.305: H3.5 24.6,65.35 28.19,61.76 28.19,43.81 36.96,35.04 36.96,19.37 38.05,18.28
USART6_TX: length 75.6
  Top Layer w0.305: H3.4 5.66,67.89 7.04,66.51 27.66,66.51 30.02,64.15 30.02,43.42 38.05,35.4 38.05,20.82
$1N5077: length 8
  Top Layer w0.305: U5.8 33.44,11.3 34.14,10.61 34.14,8.35 BAT1.2
$1N5205: length 4
  Top Layer w0.305: U5.3 20,8.76 19.49,8.25 Y1.1
$1N8903: length 12.9
  Top Layer w0.305: R36.1 21.63,24.69 22.39,23.93 KEY1.3 KEY1.4
$1N11477: length 4.1
  Top Layer w0.305: U5.2 19.9,10.03 19.19,10.75 Y1.2
$2N2294: length 10.5
  Top Layer w0.254: Q1.3 D1.2 6.85,94.1 arc(6.93,94.3) 7.14,94.38 8.23,94.38 arc(8.25,94.39) SW1.2
$2N2302: length 3.6
  Top Layer w0.254: 8.85,84.21 8.85,80.58 R1.2
$2N2313: length 10.5
  Top Layer w0.254: Q2.3 D2.2 13.22,94.1 arc(13.3,94.3) 13.5,94.38 14.6,94.38 arc(14.62,94.39) SW2.2
$2N2321: length 3.6
  Top Layer w0.254: 15.22,84.21 15.22,80.58 R3.2
$2N2332: length 10.5
  Top Layer w0.254: Q3.3 D3.2 19.59,94.1 arc(19.67,94.3) 19.87,94.38 20.97,94.38 arc(20.98,94.39) SW3.2
$2N2340: length 3.6
  Top Layer w0.254: 21.58,84.21 21.58,80.58 R5.2
$2N2351: length 10.5
  Top Layer w0.254: 25.95,85.16 D4.2 25.95,94.1 arc(26.04,94.3) 26.24,94.38 27.33,94.38 arc(27.35,94.39) SW4.2
$2N2359: length 3.6
  Top Layer w0.254: 27.95,84.21 27.95,80.58 R7.2
$2N2370: length 10.5
  Top Layer w0.254: 32.32,85.16 D5.2 32.32,94.1 arc(32.41,94.3) 32.61,94.38 33.7,94.38 arc(33.72,94.39) SW5.2
$2N2378: length 3.6
  Top Layer w0.254: 34.32,84.21 34.32,80.58 R9.2
$2N2389: length 10.5
  Top Layer w0.254: 38.69,85.16 D6.2 38.69,94.1 arc(38.77,94.3) 38.98,94.38 40.07,94.38 arc(40.09,94.39) SW6.2
$2N2397: length 3.6
  Top Layer w0.254: 40.69,84.21 40.69,80.58 R11.2
$2N2408: length 10.5
  Top Layer w0.254: 45.06,85.16 D7.2 45.06,94.1 arc(45.14,94.3) 45.34,94.38 46.44,94.38 arc(46.45,94.39) SW7.2
$2N2416: length 3.6
  Top Layer w0.254: 47.06,84.21 47.06,80.58 R13.2
$2N2427: length 10.5
  Top Layer w0.254: 51.42,85.16 51.42,94.1 arc(51.51,94.3) 51.71,94.38 52.8,94.38 arc(52.82,94.39) SW8.2
$2N2435: length 3.6
  Top Layer w0.254: 53.42,84.21 53.42,80.58 R15.2
$2N2446: length 10.5
  Top Layer w0.254: 57.79,85.16 D9.2 57.79,94.1 arc(57.88,94.3) 58.08,94.38 59.17,94.38 arc(59.19,94.39) SW9.2
$2N2454: length 3.6
  Top Layer w0.254: R17.2 59.79,80.58 59.79,84.21
$2N2465: length 10.5
  Top Layer w0.254: 64.16,85.16 D10.2 64.16,94.1 arc(64.24,94.3) 64.45,94.38 65.54,94.38 arc(65.56,94.39) SW10.2
$2N2473: length 3.6
  Top Layer w0.254: R19.2 66.16,80.58 66.16,84.21
$2N2484: length 10.5
  Top Layer w0.254: 70.53,85.16 D11.2 70.53,94.1 arc(70.61,94.3) 70.81,94.38 71.91,94.38 arc(71.92,94.39) SW11.2
$2N2492: length 3.6
  Top Layer w0.254: 72.53,84.21 72.53,80.58 R21.2
$2N2503: length 10.5
  Top Layer w0.254: 76.9,85.16 D12.2 76.9,94.1 arc(76.98,94.3) 77.18,94.38 78.27,94.38 arc(78.29,94.39) SW12.2
$2N2511: length 3.6
  Top Layer w0.254: 78.89,84.21 78.89,80.58 R23.2
$2N2522: length 10.5
  Top Layer w0.254: 83.26,85.16 D13.2 83.26,94.1 arc(83.35,94.3) 83.55,94.38 84.64,94.38 arc(84.66,94.39) SW13.2
$2N2530: length 3.6
  Top Layer w0.254: 85.26,84.21 85.26,80.58 85.26,80.58
$2N2541: length 10.5
  Top Layer w0.254: 89.63,85.16 D14.2 89.63,94.1 arc(89.71,94.3) 89.92,94.38 91.01,94.38 arc(91.03,94.39) SW14.2
$2N2549: length 3.6
  Top Layer w0.254: 91.63,84.21 91.63,80.58 R27.2
$2N2772: length 13
  Top Layer w0.305: D15.1 93.53,9.02 arc(93.54,9.01) BUZZER1.1 ; Q15.2 82.46,9.02
$2N2814: length 2.5
  Top Layer w0.305: Q15.1 82.41,12.77 R29.2
$4N2282: length 2.3
  Top Layer w0.381: LED1.2 5.88,61.62 R34.1
$4N2367: length 3.8
  Top Layer w0.305: LED2.2 18.08,62.5 18.49,62.09 R35.1
$4N4057: length 9.8
  Top Layer w0.508: DC1.1 14.15,11.29 SW15.2 SW15.3
$4N6171: length 13.6
  Top Layer w0.381: 4.47,44.58 v1(4.47,43.91)
  Top Layer w0.508: v1(12.67,45.96) 12.67,47.24 R38.1 R39.2
  Bottom Layer w0.381: v1(4.47,43.91) 12.19,43.91 12.67,44.39 v1(12.67,45.96)
$4N6183: length 4.8
  Top Layer w0.508: 21.49,36.44 21.49,31.63
$4N6184: length 3.1
  Top Layer w0.508: U9.7 18.72,33.01 19.01,33.3 LED3.1
$4N6185: length 3.1
  Top Layer w0.508: LED4.1 18.76,31.42 18.44,31.74 U9.6
$4N6187: length 3.1
  Top Layer w0.508: R41.2 9.58,32.74 9.86,33.01 U9.2
$4N7188: length 2.4
  Top Layer w0.508: R43.2 7,17.31 LED5.1
$4N10438: length 16.7
  Top Layer w0.508: CN16.1 2.54,22.55 3.3,21.78 13.61,21.78 14.15,22.32 SW15.5 SW15.4

## Copper pours and planes (outline as drawn; the poured copper is in the pictures)
GND on Top Layer: -0.41,101.55 100.56,101.55 100.56,-0.38 -0.41,-0.38
GND on Bottom Layer: -0.13,100.74 100.84,100.74 100.84,-1.19 -0.13,-1.19
VBAT on Top Layer: 0.84,53.66 5.87,53.66 5.87,39.26 0.84,39.26
$4N6170 on Top Layer: 5.94,53.71 12.04,53.71 12.04,43.04 5.94,43.04
$4N10482 on Top Layer: 8.94,41.57 15.95,41.57 15.95,38.8 8.94,38.8

Small or netless copper shapes (teardrops, artwork), in the pictures only: 450 on Top Layer, 86 on Bottom Layer

## Text on the board
Bottom Silkscreen Layer: - | PB8 | PG14 | PD3 | PB13 | PB12 | PB1 | PH3 | PA2 | PH4 | PH5 | PA7 | PC1 | PD7 | PD4 | PD11 | PC2 | PC5 | PH2 | PC4 | PA3 | PA4 | PC3 | 5V | 3.3 | GND | 3.3V | US6_TX | US6_RX | US1_TX | US1_RX | US7_RX | U3_TX | U3_RX | U4_TX | U4_RX | US7_TX
Component Marking Layer: 淘宝：反客科技
Top Silkscreen Layer: - | + | 指纹模块 | PB8 | PG14 | PD3 | PB13 | PB12 | PB1 | PH3 | PA2 | PH4 | PH5 | PA7 | PC1 | PD7 | PD4 | PD11 | PC2 | PC5 | PH2 | PC4 | PA3 | PA4 | PC3 | BAT | 电源 | 充电 | 充满 | 3.3 | 5V | 3.3V | GND | US6_TX | US6_RX | T | R | US3_TX | US3_RX | US4_TX | US4_RX | US7 | RX | TX
